# Altium schematic sheet Iot_switch.SchDoc
size A3; SheetNumber: 1; SheetTotal: 1; SPICEModelCacheRVFCGNLO: <root> / <DocumentId>RVFCGNLO</DocumentId> / <CacheFrame Number="0"> / <Model Name="cap" Kind="MDL"> / <Text>*Default semiconductor capacitor / .MODEL CAP C()</Text> / </Model> / </CacheFrame> / </root>
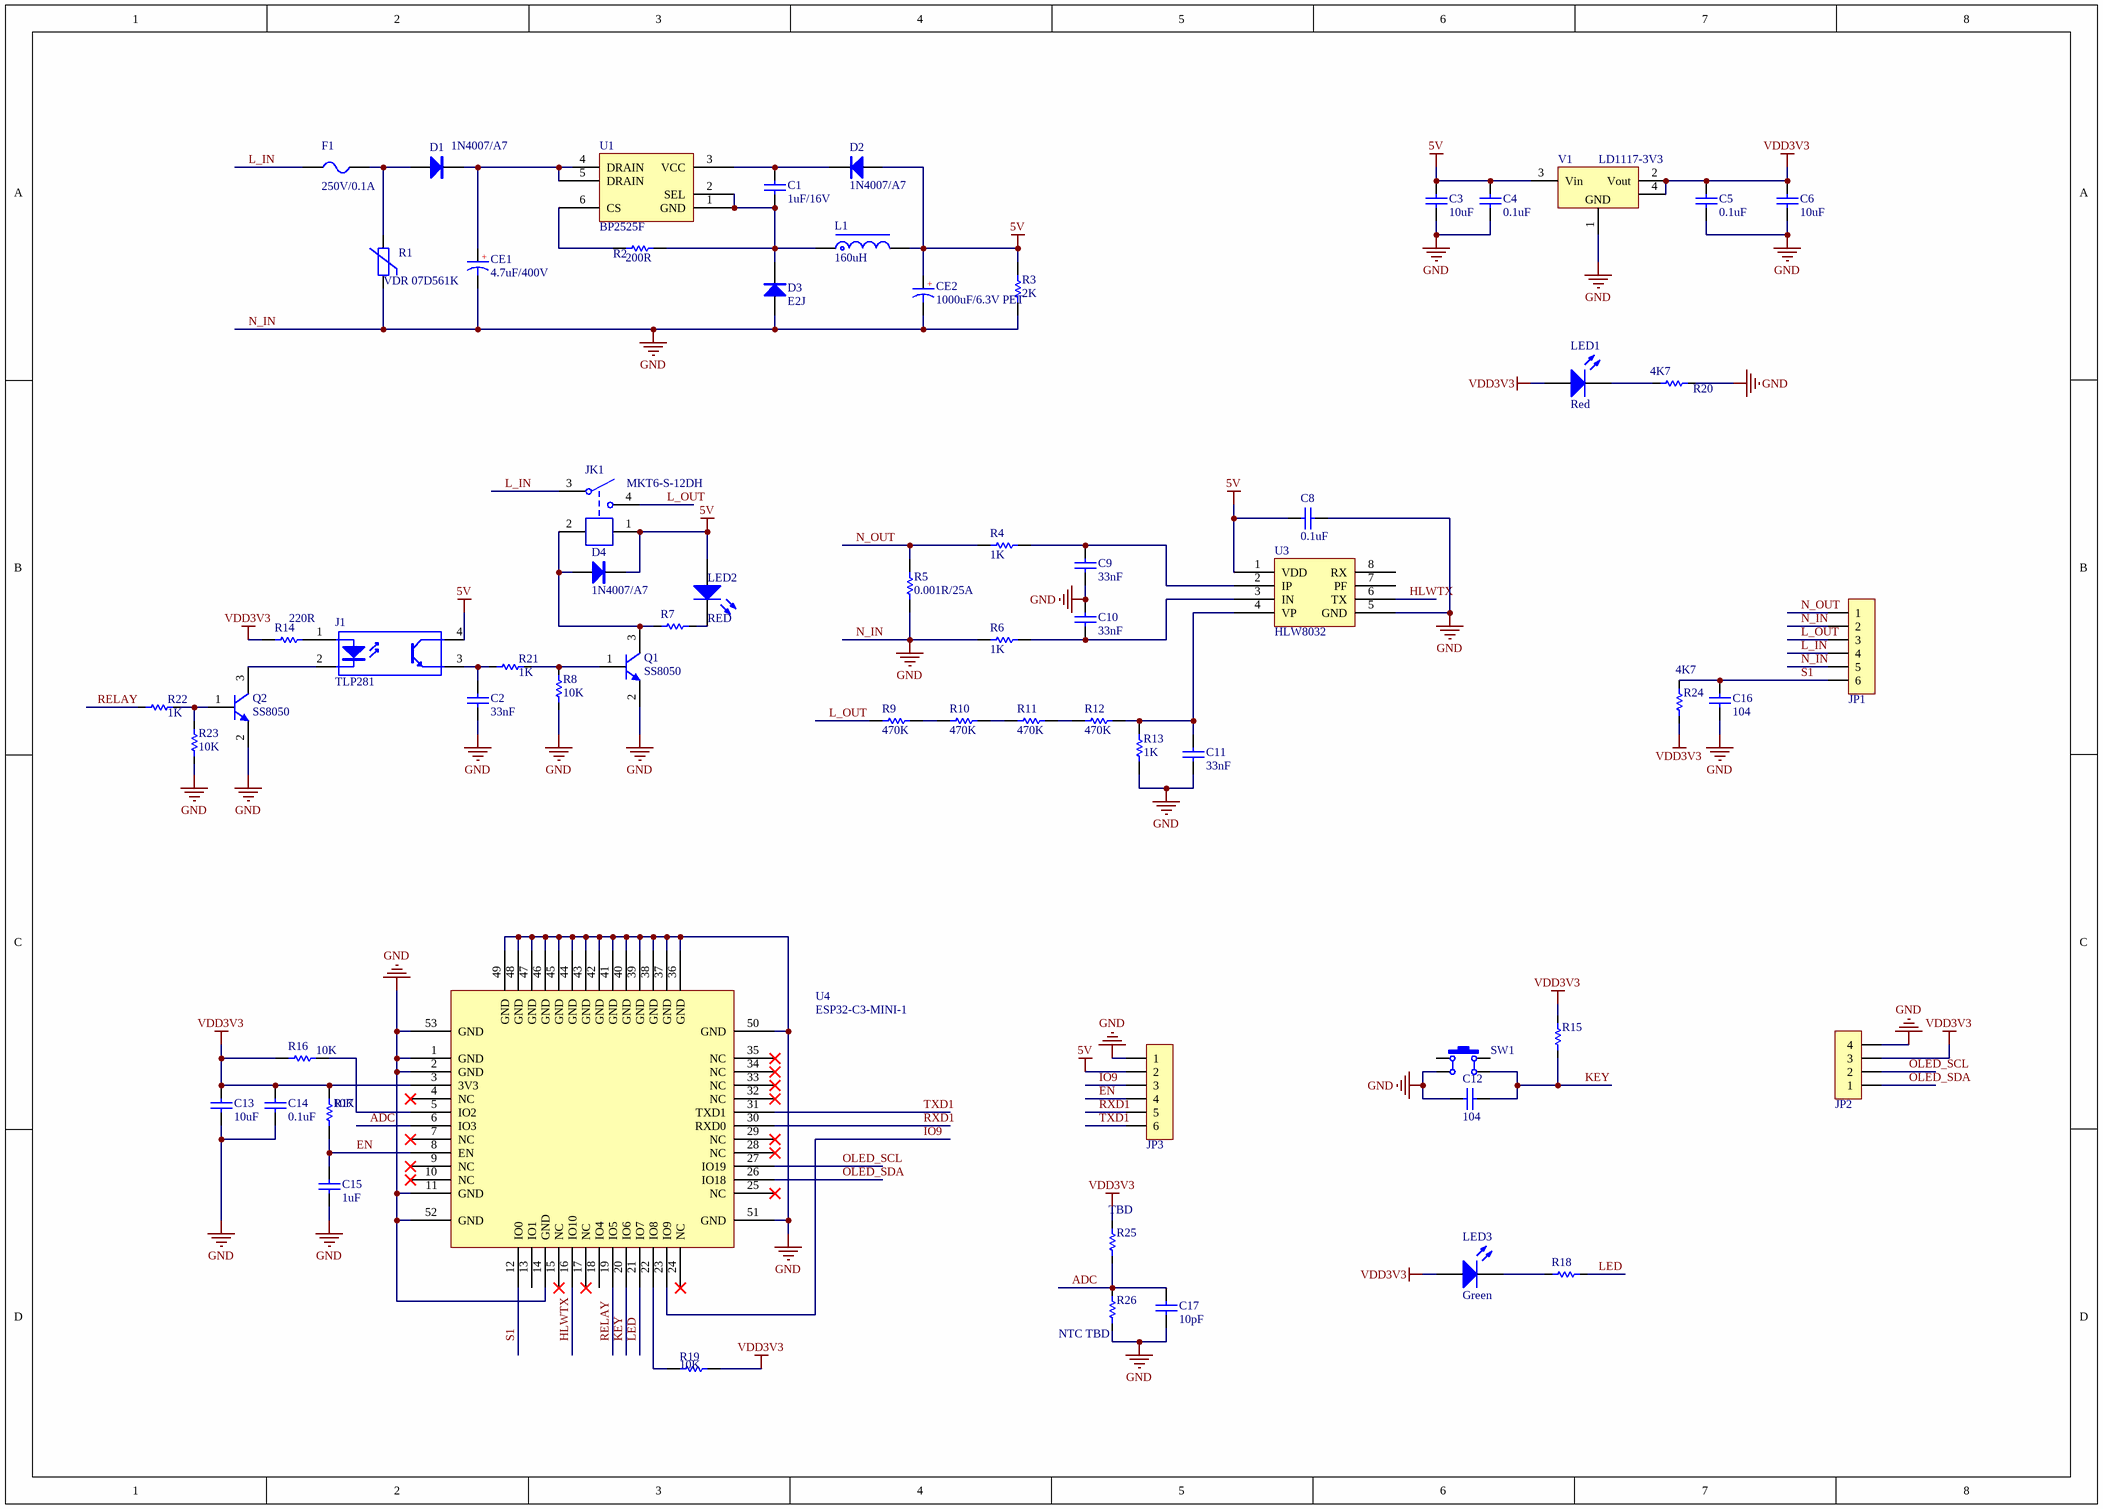
[diagram p0: Iot_switch.SchDoc]

## Parts
C1  1uF/16V  [C0805_L]
C2  33nF  [C0603_L]
C3  10uF  [C0603_L]
C4  0.1uF  [C0603_L]
C5  0.1uF  [C0603_L]
C6  10uF  [C0603_L]
C8  0.1uF  [C0603_L]
C9  33nF  [C0603_L]
C10  33nF  [C0603_L]
C11  33nF  [C0805_L]
C12  104  [C0603_L]
C13  10uF  [C0603_L]
C14  0.1uF  [C0603_L]
C15  1uF  [C0603_L]
C16  104  [C0603_L]
C17  10pF  [C0603_L]
CE1  4.7uF/400V  [CE-3.5*8*11.5]
CE2  1000uF/6.3V PET  [CE-3.5*8*11.5]
D1  1N4007/A7  [SOD-123]
D2  1N4007/A7  [SOD-123]
D3  E2J  [SOD-123]
D4  1N4007/A7  [SOD-123]
F1  250V/0.1A  [FUSE 4x16_V]
J1  TLP281  [SOP4]
JK1  MKT6-S-12DH  [MKT6-S-12DH]
JP1  HDR-1X6  [KF128-5.08-6P]  (value not drawn)
JP2  HDR-1X4  [HDR2.54-M-LI-4P]  (value not drawn)
JP3  HDR-1X6  [HDR2.54-LI-6P]  (value not drawn)
L1  160uH  [PK0608]
LED1  Red  [LED0603_R]
LED2  RED  [LED0603_R]
LED3  Green  [LED0603_G]
Q1  SS8050  [SOT23-3M]
Q2  SS8050  [SOT23-3M]
R1  VDR 07D561K  [VDR 9D-4.5]
R2  200R  [R0603_L]
R3  2K  [R0603_L]
R4  1K  [R0603_L]
R5  0.001R/25A  [R2512_L]
R6  1K  [R0603_L]
R7  4K7  [R0603_L]  (value not drawn)
R8  10K  [R0603_L]
R9  470K  [R0805_L]
R10  470K  [R0805_L]
R11  470K  [R0805_L]
R12  470K  [R0805_L]
R13  1K  [R0805_l]
R14  220R  [R0603_l]
R15  10K  [R0603_L]  (value not drawn)
R16  10K  [R0603_L]
R17  10K  [R0603_L]
R18  4K7  [R0603_L]  (value not drawn)
R19  10K  [R0603_L]
R20  4K7  [R0603_L]
R21  1K  [R0603_L]
R22  1K  [R0603_L]
R23  10K  [R0603_L]
R24  4K7  [R0603_L]
R25  TBD  [R0603_L]
R26  NTC TBD  [R0603_L]
SW1  3*4*2.5  [SW-SMD-4.2x3.2_4P]  (value not drawn)
U1  BP2525F  [SOT33-5]
U3  HLW8032  [SOP_8]
U4  ESP32-C3-MINI-1  [ESP32-C3-MINI-1]
V1  LD1117-3V3  [SOT223_L]

## Nets
5V: C3.2 C4.2 C8.2 CE2.1 D2.1(A) D4.2(K) J1.4(C) JK1.1 JP3.2 L1.2 LED2.1(A) R3.2 U3.1(VDD) V1.3(Vin)
N_IN: C2.2 C3.1 C4.1 C5.1 C6.1 C8.1 C9.2 C10.1 C11.2 C12.1 C13.1 C14.1 C15.1 C16.1 C17.2 CE1.2 CE2.2 D3.1(A) JP1.2 JP1.5 JP2.4 JP3.1 Q1.2(E) Q2.2(E) R1.1 R3.1 R5.2 R6.2 R8.2(BOT) R13.2 R20.2(BOT) R23.2(BOT) R26.1(TOP) SW1.4 U3.5(GND) U4.1(GND) U4.2(GND) U4.11(GND) U4.14(GND) U4.36(GND) U4.37(GND) U4.38(GND) U4.39(GND) U4.40(GND) U4.41(GND) U4.42(GND) U4.43(GND) U4.44(GND) U4.45(GND) U4.46(GND) U4.47(GND) U4.48(GND) U4.49(GND) U4.50(GND) U4.51(GND) U4.52(GND) U4.53(GND) V1.1(GND)  [also labelled GND]
VDD3V3: C5.2 C6.2 C13.2 C14.2 JP2.3 LED1.1(A) LED3.1(A) R14.1 R15.2(BOT) R16.1 R17.2 R19.1 R24.1(TOP) R25.2(BOT) U4.3(3V3) V1.2(Vout) V1.4(OUT)
ADC: C17.1 R25.1(TOP) R26.2(BOT) U4.6(IO3)
EN: C15.2 JP3.4 R17.1 U4.8(EN)
HLWTX: U3.6(TX) U4.16(IO10)
IO9: JP3.3 U4.23(IO9)
KEY: C12.2 R15.1(TOP) SW1.3 U4.20(IO6)
L_IN: F1.2 JK1.3 JP1.4
L_OUT: JK1.4 JP1.3 R9.2
LED: R18.2(BOT) U4.21(IO7)
N_OUT: JP1.1 R4.2 R5.1
OLED_SCL: JP2.2 U4.27(IO19)
OLED_SDA: JP2.1 U4.26(IO18)
RELAY: R22.1(TOP) U4.19(IO5)
RXD1: JP3.5 U4.30(RXD0)
S1: C16.2 JP1.6 R24.2(BOT) U4.12(IO0)
TXD1: JP3.6 U4.31(TXD1)
NetC1_1: C1.1 D3.2(K) L1.1 R2.1 U1.1(GND) U1.2(SEL)
NetC1_2: C1.2 D2.2(K) U1.3(VCC)
NetC2_1: C2.1 J1.3(E) R21.1(TOP)
NetC9_1: C9.1 R4.1 U3.2(IP)
NetC10_2: C10.2 R6.1 U3.3(IN)
NetC11_1: C11.1 R12.1 R13.1 U3.4(VP)
NetCE1_1: CE1.1 D1.2(K) U1.4(DRAIN) U1.5(DRAIN)
NetD1_1: D1.1(A) F1.1 R1.2
NetD4_1: D4.1(A) JK1.2 Q1.3(C) R7.2(BOT)
NetJ1_1: J1.1(A) R14.2
NetJ1_2: J1.2(K) Q2.3(C)
NetLED1_2: LED1.2(K) R20.1(TOP)
NetLED2_2: LED2.2(K) R7.1(TOP)
NetLED3_2: LED3.2(K) R18.1(TOP)
NetQ1_1: Q1.1(B) R8.1(TOP) R21.2(BOT)
NetQ2_1: Q2.1(B) R22.2(BOT) R23.1(TOP)
NetR2_2: R2.2 U1.6(CS)
NetR9_1: R9.1 R10.2
NetR10_1: R10.1 R11.2
NetR11_1: R11.1 R12.2
NetR16_2: R16.2 U4.5(IO2)
NetR19_2: R19.2 U4.22(IO8)

Not connected (* = marked no-connect by the designer): SW1 1 2; U3 7(PF) 8(RX); U4 4(NC)* 7(NC)* 9(NC)* 10(NC)* 13(IO1) 15(NC)* 17(NC)* 18(IO4) 24(NC)* 25(NC)* 28(NC)* 29(NC)* 32(NC)* 33(NC)* 34(NC)* 35(NC)*

## Notes on the sheet
- (in symbol CE) +

## Library data of the parts
C1 = Cap: Published: 8-Jun-2000; LatestRevisionDate: 17-Jul-2002; LatestRevisionNote: Re-released for DXP Platform.; PackageReference: RAD-0.3; Publisher: Altium Limited; PackageDescription: Radial Cap, Thru-Hole; 2 Leads; 0.3 in Pin Spacing; Value: 1uF/16V
C2-C6 = C: 贴片电容/MLCC电容; BOM名称: 无极性贴片电容
C8-C17 = C: 贴片电容/MLCC电容
CE1 CE2 = CE: 直插电解电容; BOM名称: 直插电解电容
D1-D4 = 1N4007: 整流二极管
  D1-D3: BOM名称: 整流二极管
F1 = FUSE-4x16: 4*16保险丝; BOM名称: 4x16保险丝
J1 = TLP281: 光耦
JK1 = MKT6-S-12DH: 12V一组常开
JP1 JP3 = Header 6: 6P接插件
JP2 = Header 4: 4P接插件
L1 = L-PK: 工字电感; BOM名称: 工字电感
LED1-LED3 = LED: 贴片LED
  LED1: BOM名称: 贴片LED
Q1 Q2 = BCP68: NPN三极管
R1 = R_VSR: 压敏电阻; BOM名称: 压敏电阻
R2-R6 R9-R14 R16 R17 R19 = Res1: Resistor; Published: 8-Jun-2000; LatestRevisionDate: 17-Jul-2002; LatestRevisionNote: Re-released for DXP Platform.; PackageReference: AXIAL-0.3; Publisher: Altium Limited; PackageDescription: Axial Device, Thru-Hole; 2 Leads; 0.3 in Pin Spacing
  R2: Value: 200R
  R3: Value: 2K
  R4 R6 R13: Value: 1K
  R5: Value: 0.001R/25A
  R9-R12: Value: 470K
  R14: Value: 220R
  R16 R17 R19: Value: 10K
R7 R8 R15 R18 R20-R26 = Res1: 贴片电阻; Published: 8-Jun-2000; LatestRevisionDate: 17-Jul-2002; LatestRevisionNote: Re-released for DXP Platform.; PackageReference: AXIAL-0.4; Publisher: Altium Limited
  R7 R18 R24: Value: 4K7
  R8 R15 R23: Value: 10K
  R21 R22: Value: 1K
  R25: Value: TBD
  R26: Value: NTC TBD
SW1 = SW SMD-3*4*2.5: 贴片4脚轻触开关
U1 = BP2525X
V1 = LD1117: 三端稳压芯片; BOM名称: 稳压芯片